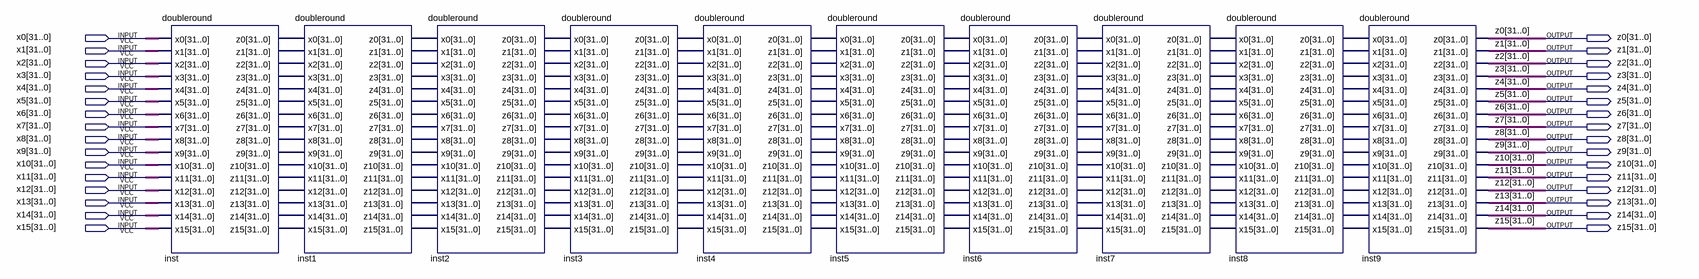
[diagram p0: schematic sheet]
// Quartus schematic doubleround10.bdf as structural Verilog: 10 symbols, 32 pins
module doubleround10 (
  input  [31:0] x0,
  input  [31:0] x1,
  input  [31:0] x2,
  input  [31:0] x3,
  input  [31:0] x4,
  input  [31:0] x5,
  input  [31:0] x6,
  input  [31:0] x7,
  input  [31:0] x8,
  input  [31:0] x9,
  input  [31:0] x10,
  input  [31:0] x11,
  input  [31:0] x12,
  input  [31:0] x13,
  input  [31:0] x14,
  input  [31:0] x15,
  output [31:0] z0,
  output [31:0] z1,
  output [31:0] z2,
  output [31:0] z3,
  output [31:0] z4,
  output [31:0] z5,
  output [31:0] z6,
  output [31:0] z7,
  output [31:0] z8,
  output [31:0] z9,
  output [31:0] z10,
  output [31:0] z11,
  output [31:0] z12,
  output [31:0] z13,
  output [31:0] z14,
  output [31:0] z15
);

  wire [31:0] inst1_z0, inst1_z1, inst1_z2, inst1_z3, inst1_z4, inst1_z5, inst1_z6, inst1_z7, inst1_z8,
       inst1_z9, inst1_z10, inst1_z11, inst1_z12, inst1_z13, inst1_z14, inst1_z15, inst2_z0, inst2_z1,
       inst2_z2, inst2_z3, inst2_z4, inst2_z5, inst2_z6, inst2_z7, inst2_z8, inst2_z9, inst2_z10, inst2_z11,
       inst2_z12, inst2_z13, inst2_z14, inst2_z15, inst3_z0, inst3_z1, inst3_z2, inst3_z3, inst3_z4,
       inst3_z5, inst3_z6, inst3_z7, inst3_z8, inst3_z9, inst3_z10, inst3_z11, inst3_z12, inst3_z13,
       inst3_z14, inst3_z15, inst4_z0, inst4_z1, inst4_z2, inst4_z3, inst4_z4, inst4_z5, inst4_z6, inst4_z7,
       inst4_z8, inst4_z9, inst4_z10, inst4_z11, inst4_z12, inst4_z13, inst4_z14, inst4_z15, inst5_z0,
       inst5_z1, inst5_z2, inst5_z3, inst5_z4, inst5_z5, inst5_z6, inst5_z7, inst5_z8, inst5_z9, inst5_z10,
       inst5_z11, inst5_z12, inst5_z13, inst5_z14, inst5_z15, inst6_z0, inst6_z1, inst6_z2, inst6_z3,
       inst6_z4, inst6_z5, inst6_z6, inst6_z7, inst6_z8, inst6_z9, inst6_z10, inst6_z11, inst6_z12,
       inst6_z13, inst6_z14, inst6_z15, inst7_z0, inst7_z1, inst7_z2, inst7_z3, inst7_z4, inst7_z5, inst7_z6,
       inst7_z7, inst7_z8, inst7_z9, inst7_z10, inst7_z11, inst7_z12, inst7_z13, inst7_z14, inst7_z15,
       inst8_z0, inst8_z1, inst8_z2, inst8_z3, inst8_z4, inst8_z5, inst8_z6, inst8_z7, inst8_z8, inst8_z9,
       inst8_z10, inst8_z11, inst8_z12, inst8_z13, inst8_z14, inst8_z15, inst_z0, inst_z1, inst_z2, inst_z3,
       inst_z4, inst_z5, inst_z6, inst_z7, inst_z8, inst_z9, inst_z10, inst_z11, inst_z12, inst_z13,
       inst_z14, inst_z15;

  doubleround inst (
    .x0(x0), .x1(x1), .x2(x2), .x3(x3), .x4(x4), .x5(x5), .x6(x6), .x7(x7), .x8(x8), .x9(x9), .x10(x10),
    .x11(x11), .x12(x12), .x13(x13), .x14(x14), .x15(x15), .z0(inst_z0), .z1(inst_z1), .z2(inst_z2),
    .z3(inst_z3), .z4(inst_z4), .z5(inst_z5), .z6(inst_z6), .z7(inst_z7), .z8(inst_z8), .z9(inst_z9),
    .z10(inst_z10), .z11(inst_z11), .z12(inst_z12), .z13(inst_z13), .z14(inst_z14), .z15(inst_z15));
  doubleround inst1 (
    .x0(inst_z0), .x1(inst_z1), .x2(inst_z2), .x3(inst_z3), .x4(inst_z4), .x5(inst_z5), .x6(inst_z6),
    .x7(inst_z7), .x8(inst_z8), .x9(inst_z9), .x10(inst_z10), .x11(inst_z11), .x12(inst_z12), .x13(inst_z13),
    .x14(inst_z14), .x15(inst_z15), .z0(inst1_z0), .z1(inst1_z1), .z2(inst1_z2), .z3(inst1_z3),
    .z4(inst1_z4), .z5(inst1_z5), .z6(inst1_z6), .z7(inst1_z7), .z8(inst1_z8), .z9(inst1_z9),
    .z10(inst1_z10), .z11(inst1_z11), .z12(inst1_z12), .z13(inst1_z13), .z14(inst1_z14), .z15(inst1_z15));
  doubleround inst2 (
    .x0(inst1_z0), .x1(inst1_z1), .x2(inst1_z2), .x3(inst1_z3), .x4(inst1_z4), .x5(inst1_z5), .x6(inst1_z6),
    .x7(inst1_z7), .x8(inst1_z8), .x9(inst1_z9), .x10(inst1_z10), .x11(inst1_z11), .x12(inst1_z12),
    .x13(inst1_z13), .x14(inst1_z14), .x15(inst1_z15), .z0(inst2_z0), .z1(inst2_z1), .z2(inst2_z2),
    .z3(inst2_z3), .z4(inst2_z4), .z5(inst2_z5), .z6(inst2_z6), .z7(inst2_z7), .z8(inst2_z8), .z9(inst2_z9),
    .z10(inst2_z10), .z11(inst2_z11), .z12(inst2_z12), .z13(inst2_z13), .z14(inst2_z14), .z15(inst2_z15));
  doubleround inst3 (
    .x0(inst2_z0), .x1(inst2_z1), .x2(inst2_z2), .x3(inst2_z3), .x4(inst2_z4), .x5(inst2_z5), .x6(inst2_z6),
    .x7(inst2_z7), .x8(inst2_z8), .x9(inst2_z9), .x10(inst2_z10), .x11(inst2_z11), .x12(inst2_z12),
    .x13(inst2_z13), .x14(inst2_z14), .x15(inst2_z15), .z0(inst3_z0), .z1(inst3_z1), .z2(inst3_z2),
    .z3(inst3_z3), .z4(inst3_z4), .z5(inst3_z5), .z6(inst3_z6), .z7(inst3_z7), .z8(inst3_z8), .z9(inst3_z9),
    .z10(inst3_z10), .z11(inst3_z11), .z12(inst3_z12), .z13(inst3_z13), .z14(inst3_z14), .z15(inst3_z15));
  doubleround inst4 (
    .x0(inst3_z0), .x1(inst3_z1), .x2(inst3_z2), .x3(inst3_z3), .x4(inst3_z4), .x5(inst3_z5), .x6(inst3_z6),
    .x7(inst3_z7), .x8(inst3_z8), .x9(inst3_z9), .x10(inst3_z10), .x11(inst3_z11), .x12(inst3_z12),
    .x13(inst3_z13), .x14(inst3_z14), .x15(inst3_z15), .z0(inst4_z0), .z1(inst4_z1), .z2(inst4_z2),
    .z3(inst4_z3), .z4(inst4_z4), .z5(inst4_z5), .z6(inst4_z6), .z7(inst4_z7), .z8(inst4_z8), .z9(inst4_z9),
    .z10(inst4_z10), .z11(inst4_z11), .z12(inst4_z12), .z13(inst4_z13), .z14(inst4_z14), .z15(inst4_z15));
  doubleround inst5 (
    .x0(inst4_z0), .x1(inst4_z1), .x2(inst4_z2), .x3(inst4_z3), .x4(inst4_z4), .x5(inst4_z5), .x6(inst4_z6),
    .x7(inst4_z7), .x8(inst4_z8), .x9(inst4_z9), .x10(inst4_z10), .x11(inst4_z11), .x12(inst4_z12),
    .x13(inst4_z13), .x14(inst4_z14), .x15(inst4_z15), .z0(inst5_z0), .z1(inst5_z1), .z2(inst5_z2),
    .z3(inst5_z3), .z4(inst5_z4), .z5(inst5_z5), .z6(inst5_z6), .z7(inst5_z7), .z8(inst5_z8), .z9(inst5_z9),
    .z10(inst5_z10), .z11(inst5_z11), .z12(inst5_z12), .z13(inst5_z13), .z14(inst5_z14), .z15(inst5_z15));
  doubleround inst6 (
    .x0(inst5_z0), .x1(inst5_z1), .x2(inst5_z2), .x3(inst5_z3), .x4(inst5_z4), .x5(inst5_z5), .x6(inst5_z6),
    .x7(inst5_z7), .x8(inst5_z8), .x9(inst5_z9), .x10(inst5_z10), .x11(inst5_z11), .x12(inst5_z12),
    .x13(inst5_z13), .x14(inst5_z14), .x15(inst5_z15), .z0(inst6_z0), .z1(inst6_z1), .z2(inst6_z2),
    .z3(inst6_z3), .z4(inst6_z4), .z5(inst6_z5), .z6(inst6_z6), .z7(inst6_z7), .z8(inst6_z8), .z9(inst6_z9),
    .z10(inst6_z10), .z11(inst6_z11), .z12(inst6_z12), .z13(inst6_z13), .z14(inst6_z14), .z15(inst6_z15));
  doubleround inst7 (
    .x0(inst6_z0), .x1(inst6_z1), .x2(inst6_z2), .x3(inst6_z3), .x4(inst6_z4), .x5(inst6_z5), .x6(inst6_z6),
    .x7(inst6_z7), .x8(inst6_z8), .x9(inst6_z9), .x10(inst6_z10), .x11(inst6_z11), .x12(inst6_z12),
    .x13(inst6_z13), .x14(inst6_z14), .x15(inst6_z15), .z0(inst7_z0), .z1(inst7_z1), .z2(inst7_z2),
    .z3(inst7_z3), .z4(inst7_z4), .z5(inst7_z5), .z6(inst7_z6), .z7(inst7_z7), .z8(inst7_z8), .z9(inst7_z9),
    .z10(inst7_z10), .z11(inst7_z11), .z12(inst7_z12), .z13(inst7_z13), .z14(inst7_z14), .z15(inst7_z15));
  doubleround inst8 (
    .x0(inst7_z0), .x1(inst7_z1), .x2(inst7_z2), .x3(inst7_z3), .x4(inst7_z4), .x5(inst7_z5), .x6(inst7_z6),
    .x7(inst7_z7), .x8(inst7_z8), .x9(inst7_z9), .x10(inst7_z10), .x11(inst7_z11), .x12(inst7_z12),
    .x13(inst7_z13), .x14(inst7_z14), .x15(inst7_z15), .z0(inst8_z0), .z1(inst8_z1), .z2(inst8_z2),
    .z3(inst8_z3), .z4(inst8_z4), .z5(inst8_z5), .z6(inst8_z6), .z7(inst8_z7), .z8(inst8_z8), .z9(inst8_z9),
    .z10(inst8_z10), .z11(inst8_z11), .z12(inst8_z12), .z13(inst8_z13), .z14(inst8_z14), .z15(inst8_z15));
  doubleround inst9 (
    .x0(inst8_z0), .x1(inst8_z1), .x2(inst8_z2), .x3(inst8_z3), .x4(inst8_z4), .x5(inst8_z5), .x6(inst8_z6),
    .x7(inst8_z7), .x8(inst8_z8), .x9(inst8_z9), .x10(inst8_z10), .x11(inst8_z11), .x12(inst8_z12),
    .x13(inst8_z13), .x14(inst8_z14), .x15(inst8_z15), .z0(z0), .z1(z1), .z2(z2), .z3(z3), .z4(z4), .z5(z5),
    .z6(z6), .z7(z7), .z8(z8), .z9(z9), .z10(z10), .z11(z11), .z12(z12), .z13(z13), .z14(z14), .z15(z15));
endmodule
